# EAGLE design switchy_stamp_pth_mk1_inverting (EAGLE 6.4)
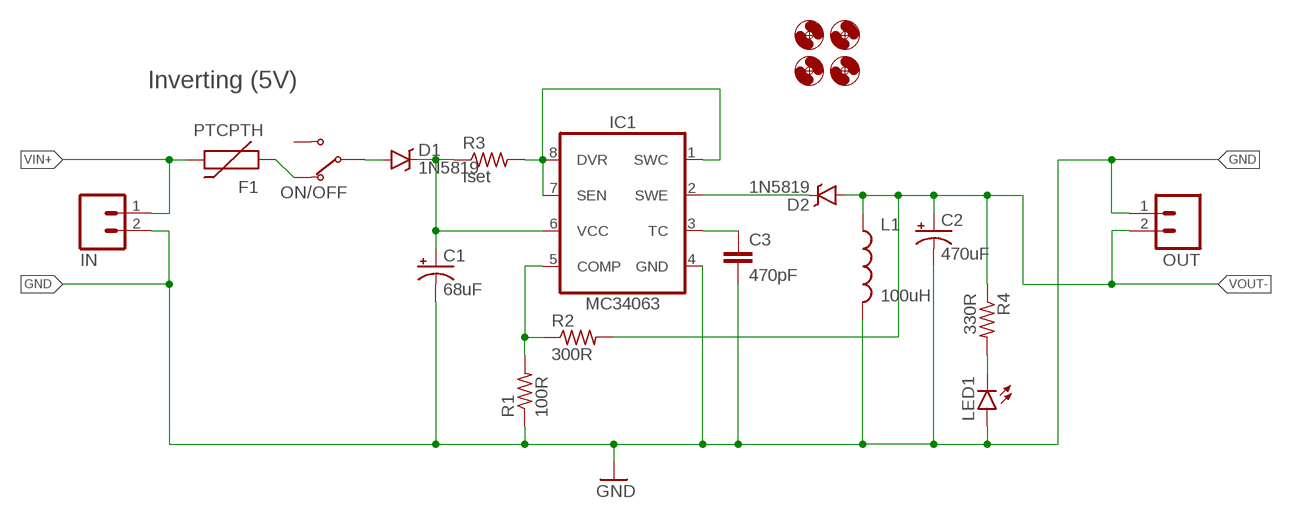
[diagram p0: schematic, sheet 1]

## Parts
C1  68uF  CAPACITOR-POLARIZEDE2.5-6  [E2,5-6]
C2  470uF  CAPACITOR-POLARIZEDE2.5-7  [E2,5-7]
C3  470pF  CAPACITOR-CERAMIC025-024X044  [C025-024X044]
D1  1N5819  DIODE-SCHOTTKYDO-41  [DO-41]
D2  1N5819  DIODE-SCHOTTKYDO-41  [DO-41]
F1  PTCPTH  [PTC]
H1  HOLE#4  [HOLE-#4]
H2  HOLE#4  [HOLE-#4]
H3  HOLE#4  [HOLE-#4]
H4  HOLE#4  [HOLE-#4]
IC1  MC34063  MC34063DIP  [DIP-08]
IN  M02JST-PTH-2  [JST-2-PTH]
L1  100uH  INDUCTORRLB0912  [RLB0912]
LED1  LED3MM  [LED3MM]
ON/OFF  SWITCH-SPDTPTH-RA-2.54MM  [SPDT-RA-2.54MM]
OUT  M02JST-PTH-2  [JST-2-PTH]
R1  100R  RESISTORPTH-AXIAL-5.08MM  [RESISTOR-AXIAL-PTH-5.08MM]
R2  300R  RESISTORPTH-AXIAL-5.08MM  [RESISTOR-AXIAL-PTH-5.08MM]
R3  Iset  RESISTOR  [RESISTOR-AXIAL-PTH-10.16MM]
R4  330R  RESISTORPTH-AXIAL-5.08MM  [RESISTOR-AXIAL-PTH-5.08MM]

## Nets
GND: C1.- C2.- C3.2 IC1.4(GND) IN.2 L1.2 LED1.A OUT.1 R1.P$1
N$1: IC1.1(SWC) IC1.7(SEN) IC1.8(DVR) R3.P$2
N$2: C3.1 IC1.3(TC)
N$3: IC1.5(COMP) R1.P$2 R2.P$1
N$4: D1.A ON/OFF.2(COM)
N$5: C1.+ D1.C IC1.6(VCC) R3.P$1
N$6: D2.C IC1.2(SWE)
N$7: LED1.K(C) R4.P$2
N$8: F1.P$1 ON/OFF.1(NC)
VIN+: F1.P$2 IN.1
VOUT-: C2.+ D2.A L1.1 OUT.2 R2.P$2 R4.P$1
Unconnected: ON/OFF.3(NO)

## Notes on the sheet
- Inverting (5V)

## Library data of the parts
C1 C2 = A_butts:CAPACITOR-POLARIZED: POLARIZED CAPACITOR, American symbol
C3 = A_butts:CAPACITOR-CERAMIC: CAPACITOR, European symbol
D1 D2 = A_butts:DIODE-SCHOTTKY: Schottky diodes in SFE's production catalog BAT20J 1A 23V 0.62Vf RB751 120mA 40V 0.37Vf PMEG4005EJ 0.5A 40V 0.42Vf MBRA140 1A 40V 0.5Vf B340A 3A 40V SMA
F1 = A_butts:PTC: Resettable Fuse PTC Resettable Fuse. Spark Fun Electronics SKU : COM-08357
H1-H4 = A_butts:HOLE: MOUNTING HOLE with drill center marker
IC1 = A_butts:MC34063: Jellybean switching supply controller
IN OUT = A_butts:M02: Standard 2-pin 0.1" header. Use with - straight break away headers ( PRT-00116) - right angle break away headers (PRT-00553) - swiss pins (PRT-00743) - machine pins (PRT-00117) - female headers (PRT-00115) Molex polarized connector foot print use with: PRT-08233 with associated crimp pins and housings. 2.54_SCREWTERM for use with PRT-10571. 3.5mm Screw Terminal footprints for PRT-08084 5mm Screw Terminal footprints for use with PRT-08433; SKU: PRT-09914
L1 = A_butts:INDUCTOR: Inductors Basic Inductor/Choke - 0603 and 1206. Footprints are not proven and vary greatly between part numbers. SRN6045- 33uH, 20% 1.4A SDR0403-560KL - 56uH, 10%, 500mA RMS/740mA peak
LED1 = A_butts:LED: LEDs Standard schematic elements and footprints for 5mm, 3mm, 1206, and 0603 sized LEDs. 5mm - Spark Fun Electronics SKU : COM-00529 (and others)
ON/OFF = A_butts:SWITCH-SPDT
R1-R4 = A_butts:RESISTOR: RESISTOR, American symbol

## Board
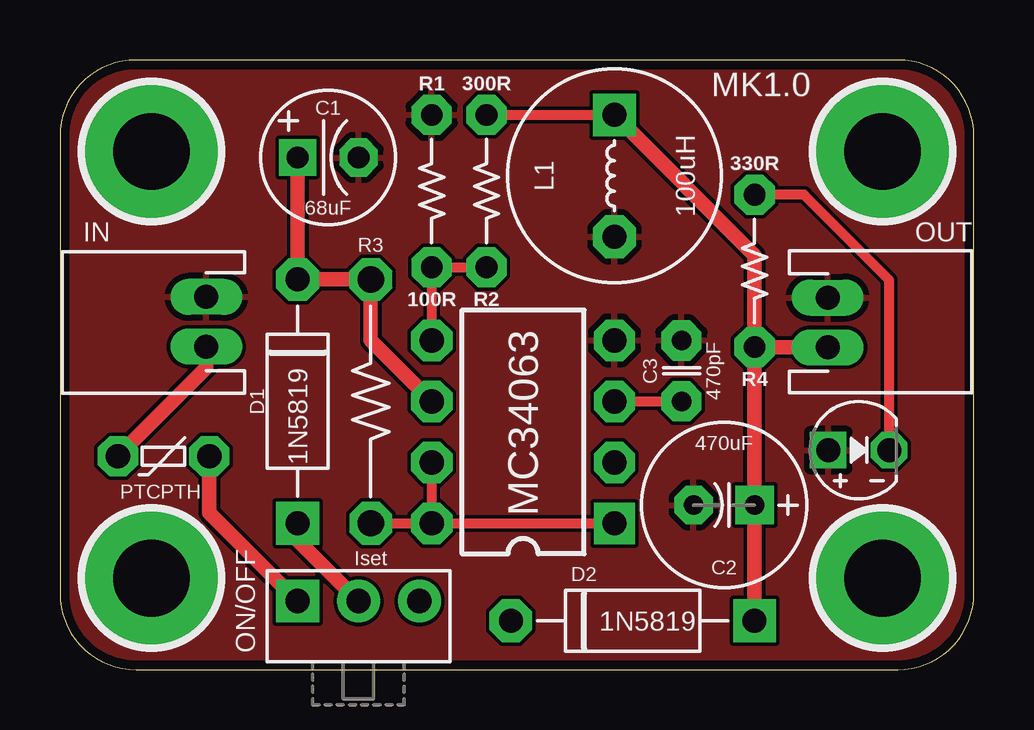
[diagram p1: board, top side]
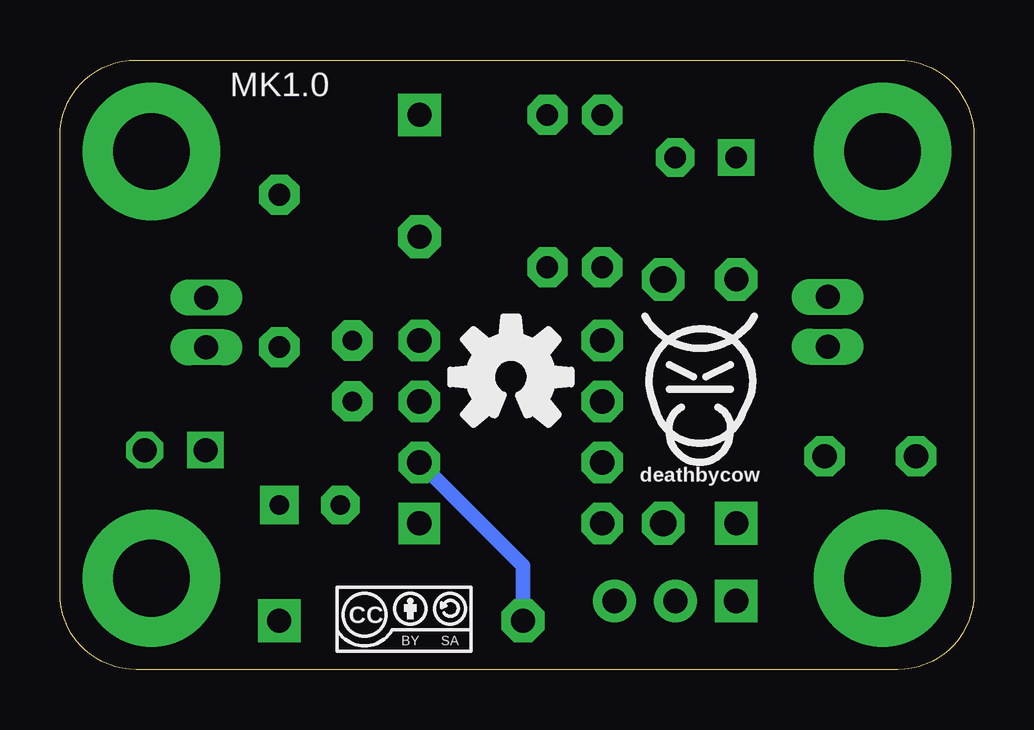
[diagram p2: board, bottom side, seen from below]

Size 38.1 x 25.4 mm. Coordinates in mm from the lower left corner, seen from the top.
Outline: 0,22.23 0,3.17 arc90 3.17,0 34.92,0 arc90 38.1,3.17 38.1,22.23 arc90 34.92,25.4 3.17,25.4 arc90 0,22.23
Copper layers (1*16): Top 0.0356mm / dielectric 1.5011mm / Bottom 0.0356mm
Design rules "LaenPCBOrder2": minimum track width 6mil, minimum drill 13mil, track to track 6mil, track to pad 6mil, pad to pad 6mil, via to via 6mil, smd to smd 6mil, copper to edge 15mil, drill to drill 6mil, minimum pad ring 7mil, minimum via ring 7mil, stop-mask expansion 3mil, vias tented up to drill 20mil, thermal gap 10mil

### Footprints (pad centres in the part's own frame; a part is rotated, then mirrored left to right if it is on the bottom)
E2,5-6 = drill 0.9 pad 1.524 square: + -1.27,0 | drill 0.9 pad 1.6 octagon: - 1.27,0
E2,5-7 = drill 0.813 pad 1.6 square: + -1.27,0 | drill 0.813 pad 1.6 octagon: - 1.27,0
C025-024X044 = drill 0.813 pad 1.676 octagon: 1 -1.27,0; 2 1.27,0
DO-41 = drill 1 pad 1.778 square: A -5.08,0 | drill 1 pad 1.778 octagon: C 5.08,0
PTC = drill 1.016 pad 1.676 octagon: P$1 -1.905,0; P$2 1.905,0
HOLE-#4 = drill 3.2 pad 5.715: P$1 0,0
DIP-08 = drill 1.016 pad 1.727 square: 1 -3.81,-3.81 | drill 1.016 pad 1.727 octagon: 2 -1.27,-3.81; 3 1.27,-3.81; 4 3.81,-3.81; 5 3.81,3.81; 6 1.27,3.81; 7 -1.27,3.81; 8 -3.81,3.81
JST-2-PTH = drill 1 pad 1.5 long: 1 0,0; 2 2.064,0
RLB0912 = drill 1 pad 1.778 square: 1 2.54,0 | drill 1 pad 1.778 octagon: 2 -2.54,0
LED3MM = drill 1 pad 1.524 square: A -1.27,0 | drill 1 pad 1.524 octagon: K 1.27,0
SPDT-RA-2.54MM = drill 1.016 pad 1.778 square: 1 0,0 | drill 1.016 pad 1.778: 2 2.54,0; 3 5.08,0
RESISTOR-AXIAL-PTH-5.08MM = drill 0.9 pad 1.676 octagon: P$1 -3.175,0; P$2 3.175,0
RESISTOR-AXIAL-PTH-10.16MM = drill 1.1 pad 1.778 octagon: P$1 -5.08,0; P$2 5.08,0

### Placement (x,y rotation side)
C1  11.18,21.34 0 top
C2  27.69,6.86 180 top
C3  25.91,12.45 90 top
D1  9.91,11.18 90 top
D2  23.88,2.03 180 top
F1  4.32,8.89 180 top
H1  34.29,21.59 0 top
H2  3.81,21.59 0 top
H3  34.29,3.81 0 top
H4  3.81,3.81 0 top
IC1  19.3,9.91 90 top
IN  6.1,13.46 90 top
L1  23.11,20.57 90 top
LED1  33.3,9.14 0 top
ON/OFF  9.91,2.86 0 top
OUT  32,15.49 270 top
R1  15.49,19.94 270 top
R2  17.78,19.94 90 top
R3  12.95,11.18 270 top
R4  28.96,16.61 90 top
U$1  [CC-BY-SA-4.0-NO-URL]  25.4,2.29 0 bottom
U$2  [COW_SMALL]  11.43,12.19 0 bottom
U$3  [OSHWLOGO_BOT_0.2_A]  19.3,12.19 0 top

### Tracks (layer width: path | path; a pad name or v marks a point on that pad's centre or on a via)
GND
  pour Top (isolate 0.152): 34.92,0 3.17,0 arc-90 0,3.17 0,22.23 arc-90 3.17,25.4 34.92,25.4 arc-90 38.1,22.23 38.1,3.17 arc-90
N$1
  Top 0.406: R3.P$2 IC1.8 | IC1.7 IC1.8 | IC1.8 IC1.1
N$2
  Top 0.406: IC1.3 C3.1
N$3
  Top 0.406: IC1.5 R1.P$2 R2.P$1
N$4
  Top 0.61: D1.A 9.91,5.4 ON/OFF.2
N$5
  Top 0.61: IC1.6 12.95,13.72 R3.P$1 D1.C C1.+
N$6
  Bottom 0.61: IC1.2 18.8,4.32 D2.C
N$7
  Top 0.406: LED1.K 34.57,16.23 31.01,19.79 R4.P$2
N$8
  Top 0.61: F1.P$1 6.22,6.54 ON/OFF.1
VIN+
  Top 0.61: IN.1 6.1,12.57 F1.P$2
VOUT-
  Top 0.406: R2.P$2 L1.1
  Top 0.61: L1.1 28.96,17.27 R4.P$1 | OUT.2 R4.P$1 | D2.A C2.+ R4.P$1

### Text on the board
tPlace: MK1.0
bPlace: MK1.0